# Altium schematic sheet LED_Connector.SchDoc
size A4; SheetNumber: 10; SheetTotal: 10
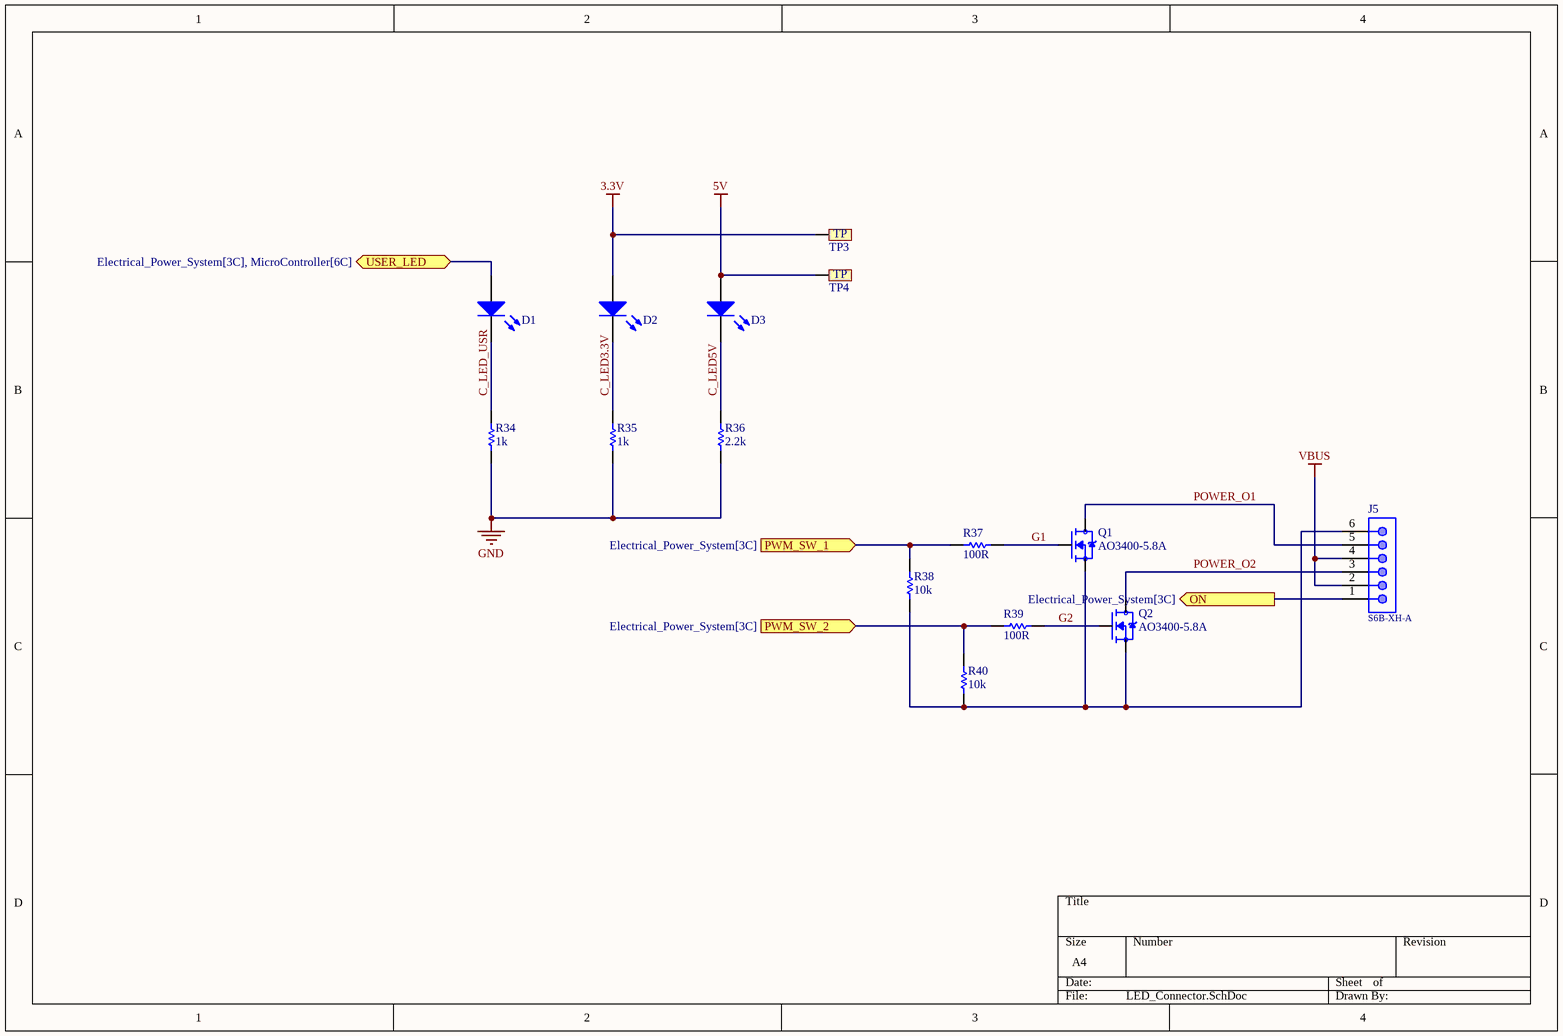
[diagram p0: LED_Connector.SchDoc]

## Parts
D1  LED SMD  [LED_0805_Blue]  (value not drawn)
D2  LED SMD  [LED_0805_Blue]  (value not drawn)
D3  LED SMD  [LED_0805_Blue]  (value not drawn)
J5  S6B-XH-A  [S6B-XH-A]
Q1  AO3400-5.8A  [SOT95P260X140-3N]
Q2  AO3400-5.8A  [SOT95P260X140-3N]
R34  value 1k  [RES-SM-0805]  (hidden comment: RESISTOR SMD)
R35  value 1k  [RES-SM-0805]  (hidden comment: RESISTOR SMD)
R36  value 2.2k  [RES-SM-0805]  (hidden comment: RESISTOR SMD)
R37  value 100R  [RES-SM-0805]  (hidden comment: RESISTOR SMD)
R38  value 10k  [RES-SM-0805]  (hidden comment: RESISTOR SMD)
R39  value 100R  [RES-SM-0805]  (hidden comment: RESISTOR SMD)
R40  value 10k  [RES-SM-0805]  (hidden comment: RESISTOR SMD)
TP3  Test Point  [TP]  (value not drawn)
TP4  Test Point  [TP]  (value not drawn)

## Ports
ON (out, see Electrical_Power_System[3C]), PWM_SW_1 (in, see Electrical_Power_System[3C]), PWM_SW_2 (in, see Electrical_Power_System[3C]), USER_LED (bidir, see Electrical_Power_System[3C], MicroController[6C])

## Nets
3.3V: D2.1(A) TP3.TP1
5V: D3.1(A) TP4.TP1
GND: R34.2 R35.2 R36.2
VBUS: J5.2 J5.4
C_LED3.3V: D2.2(K) R35.1
C_LED5V: D3.2(K) R36.1
C_LED_USR: D1.2(K) R34.1
G1: Q1.1(G) R37.2
G2: Q2.1(G) R39.2
ON: J5.1 ; port ON
POWER_O1: J5.5 Q1.3(D)
POWER_O2: J5.3 Q2.3(D)
PWM_SW_1: R37.1 R38.1 ; port PWM_SW_1
PWM_SW_2: R39.1 R40.1 ; port PWM_SW_2
USER_LED: D1.1(A) ; port USER_LED
NetJ5_6: J5.6 Q1.2(S) Q2.2(S) R38.2 R40.2

## Notes on the sheet
- (in symbol Test Point) TP

## Library data of the parts
D1-D3 = LED SMD: LED
J5 = S6B-XH-A: WR-PHD Pin Header, THT, pitch 2.54mm, Single Row, Angled, 6p; Manufacturer Part Number: 61300611021; Manufacturer: Wurth Elektronik; Pin Number: 6; Rated Current: 3A; Working Voltage: 250VAC; Withstanding Voltage: 500VAC; Contact Resistance: 20mOhm; Supply Name 1: Mouser; ComponentLink1Description: Manufacturer; ComponentLink1URL: http://www.we-online.de; ComponentLink2Description: Datasheet; ComponentLink2URL: https://www.we-online.com/catalog/datasheet/61300611021.pdf; Published Date: May 2020; Pitch: 2.54mm; Operating Temperature: -40 to +105degC; Mounting Technology: THT; Packaging: Bag; Gender: Pin Header; Row Number: Single; Orientation: Angled; ComponentLink3Description: Global Supply; ComponentLink3URL: https://www.we-online.com/en/components/products/PHD_2_54_THT_ANGLED_PIN_HEADER_6130XX11021?sq=61300611021#61300611021; ComponentLink4Description: Global Supply; ComponentLink4URL: https://www.mouser.vn/ProductDetail/Wurth-Elektronik/61300611021?qs=PhR8RmCirEaego3UjbXiZA%3D%3D; Supplier 1 Name: Mouser; Supplier 1 SN: 710-61300611021; Supplier 1 URL: https://www.mouser.vn/ProductDetail/Wurth-Elektronik/61300611021?qs=PhR8RmCirEaego3UjbXiZA%3D%3D; Supplier 2 Name: Digi-Key; Supplier 2 SN: N/A; Supplier 2 URL: N/A; Supplier 3 Name: thegioiic; Supplier 3 SN: N/A; Supplier 3 URL: N/A
Q1 Q2 = AO3400-5.8A: N-Channel 30 V 5.8A (Ta) 1.5W (Ta) Surface Mount SOT-23; MF: MDD; Check_prices: https://www.snapeda.com/parts/AO3400-5.8A/MDD/view-part/?ref=eda; Value: *; Availability: In Stock; MP: AO3400-5.8A; Price: None; Package: None; SnapEDA_Link: https://www.snapeda.com/parts/AO3400-5.8A/MDD/view-part/?ref=snap; Purchase-URL: https://pricing.snapeda.com/search/part/AO3400-5.8A/?ref=eda
R34-R40 = RESISTOR SMD: Resistor